# Altium schematic sheet BNO055.SchDoc
size A; SheetNumber: 4; SheetTotal: 4
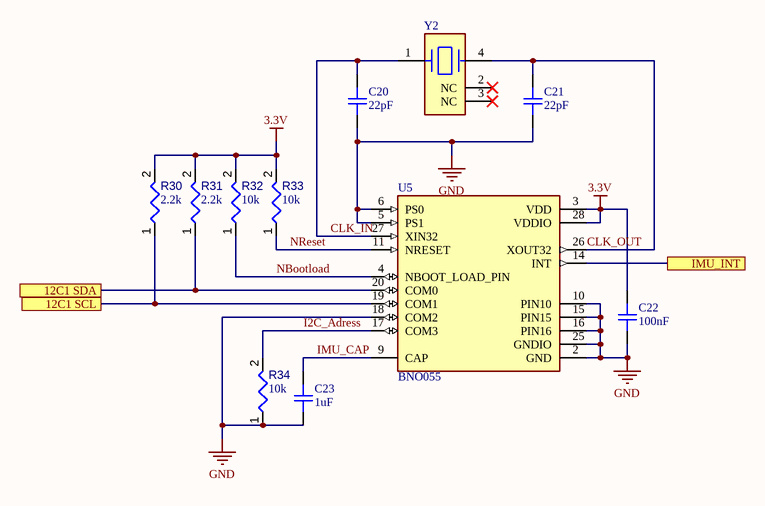
[diagram p0: BNO055.SchDoc]

## Parts
C20  22pF  [CAP_0603]
C21  22pF  [CAP_0603]
C22  100nF  [CAP_0603]
C23  1uF  [CAP_0603]
R30  value 2.2k  [RESC0402(1005)_L]  (hidden comment: 324KR2F)
R31  value 2.2k  [RESC0402(1005)_L]  (hidden comment: 324KR2F)
R32  value 10k  [RESC0402(1005)_L]  (hidden comment: 324KR2F)
R33  value 10k  [RESC0402(1005)_L]  (hidden comment: 324KR2F)
R34  value 10k  [RESC0402(1005)_L]  (hidden comment: 324KR2F)
U5  BNO055  [LGA28R50P4X10_380X520X100]
Y2  ABS25-32.768KHZ-T  [FP-ABS25-MFG]  (value not drawn)

## Ports
12C1 SCL, 12C1 SDA, IMU_INT

## Nets
3.3V: C22.2 R30.2 R31.2 R32.2 R33.2 U5.3(VDD) U5.28(VDDIO)
GND: C20.1 C21.1 C22.1 C23.1 R34.1 U5.2(GND) U5.5(PS1) U5.6(PS0) U5.10(PIN10) U5.15(PIN15) U5.16(PIN16) U5.18(COM2) U5.25(GNDIO)
12C1 SCL: R30.1 U5.19(COM1) ; port 12C1 SCL
12C1 SDA: R31.1 U5.20(COM0) ; port 12C1 SDA
CLK_IN: C20.2 U5.27(XIN32) Y2.1
CLK_OUT: C21.2 U5.26(XOUT32) Y2.4
I2C_Adress: R34.2 U5.17(COM3)
IMU_CAP: C23.2 U5.9(CAP)
IMU_INT: U5.14(INT) ; port IMU_INT
NBootload: R32.1 U5.4(NBOOT_LOAD_PIN)
NReset: R33.1 U5.11(NRESET)

Not connected (* = marked no-connect by the designer): Y2 2(NC)* 3(NC)*

## Library data of the parts
C20-C23 = CAP_0603: Capacitor SMD 0603; Manufacturer: *; Manufacturer Part Number: *; Distributor Link: *; LCSC: *; Rating: *; Dielectric: *
R30-R34 = CMP-009-00094-2: 324K 0.063W 1% 0402 (1005 Metric)  SMD; Power: 63mW; Tolerance: 1%; Pins: 2; Mounting Technology: SMT; Case/Package: 0402
U5 = BNO055: BNO055 9-axis Absolute Orientation Sensor ( SiP ) w/Sensors and Sensor Fusion; Package: None; Price: None; Value: *; MP: BNO055; Availability: Unavailable
Y2 = CMP-2000-05037-2: CRYSTAL 32.7680KHZ 12.5PF SMD; ESR (Equivalent Series Resistance): 50kR; Tolerance: 20ppm; Width: 3.8mm; REACH SVHC: No SVHC; Load Capacitance: 12.5pF; Case/Package: SMD/SMT; Radiation Hardening: No; Series: ABS25; Number of Pins: 4; Mount: Surface Mount; RoHS Compliant: Yes; Packaging: Tape and Reel; Termination: SMD/SMT; Frequency Tolerance: 20ppm; Lead Free: Lead Free; Package Quantity: 1000; Min Operating Temperature: -40°C; Height: 0.098inch; Length: 8mm; Frequency: 32.768kHz; Max Operating Temperature: 85°C; Series Resistance: 50kR; Operating Frequency: 32.768 kHz; Depth: 3.8mm